# EAGLE design video_xchng_v4 (EAGLE 9.6.2)
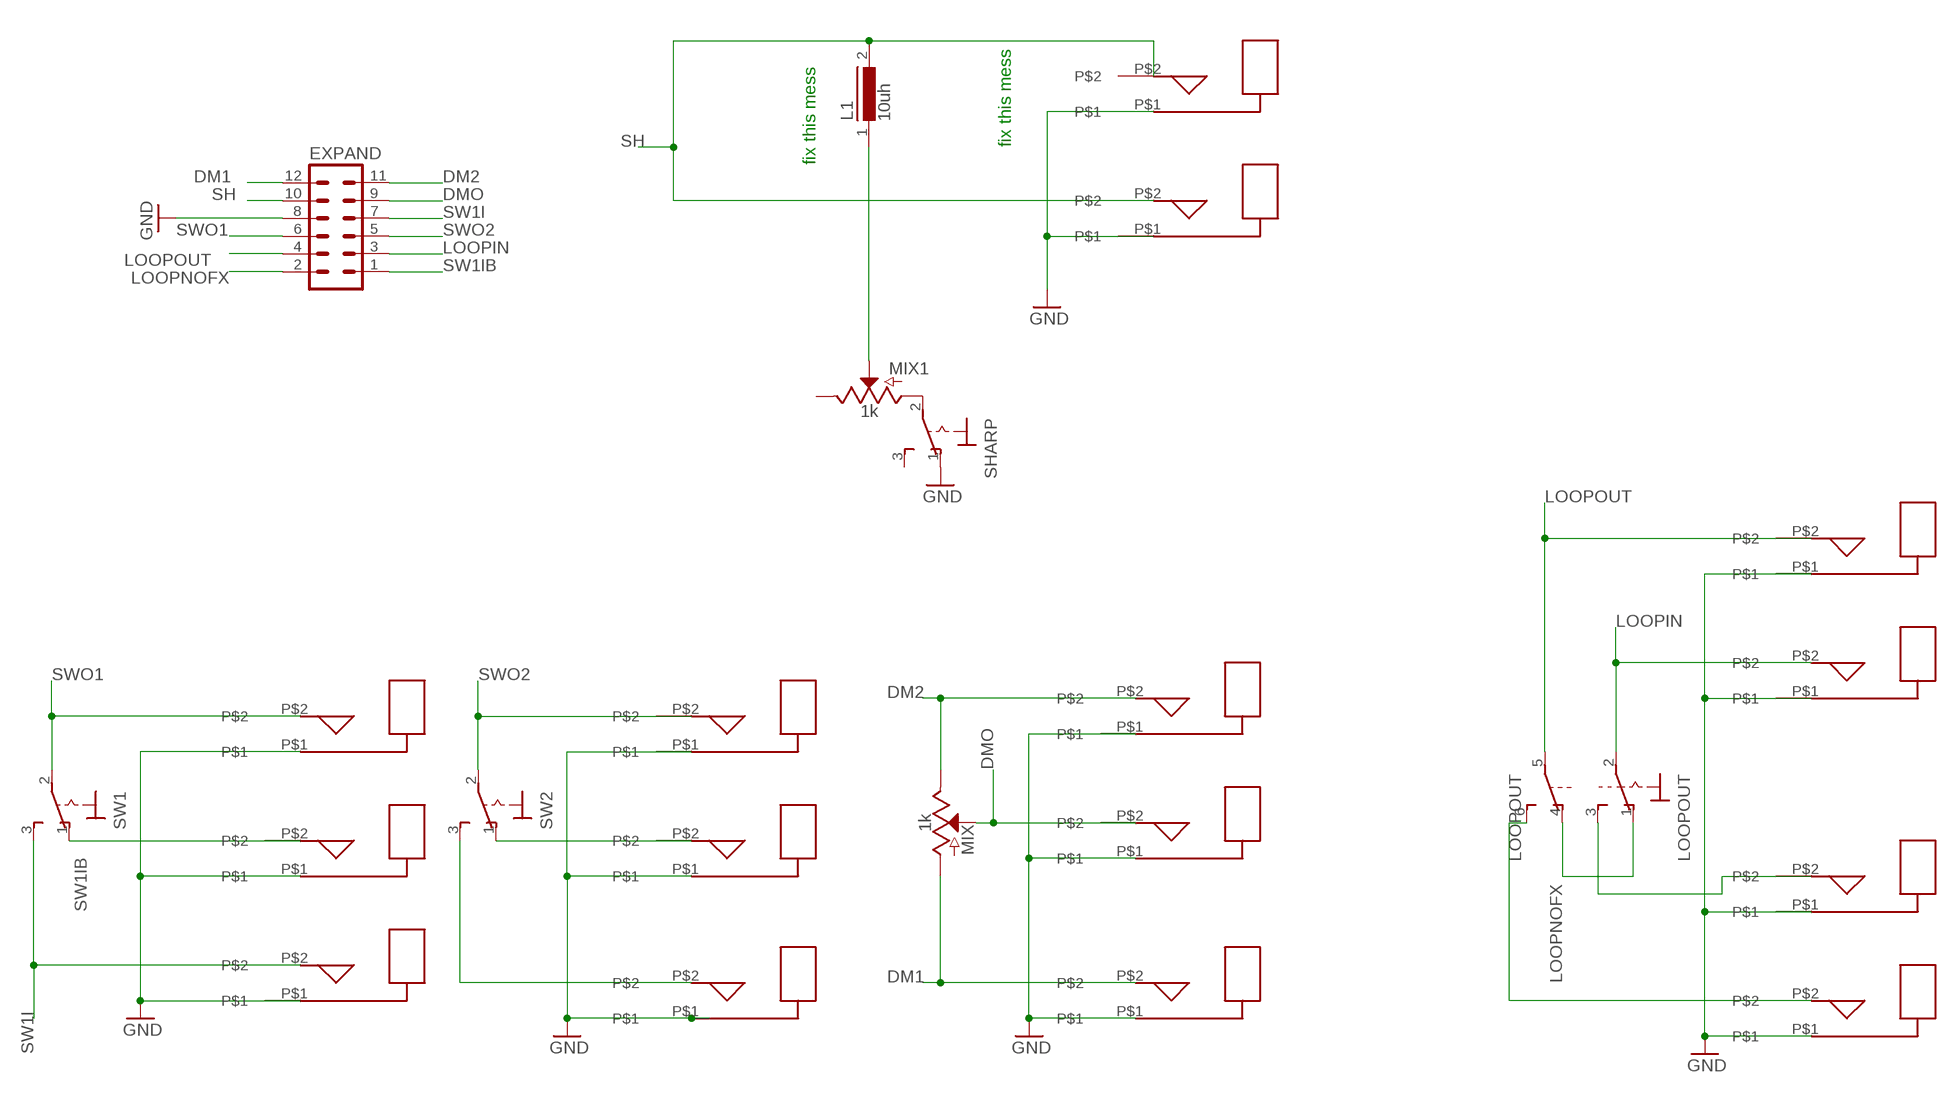
[diagram p0: schematic, sheet 1]

## Parts
EXPAND  MA06-2  [MA06-2]
L1  10uh  LBC15  [LBC15]
LOOPOUT  M9040P2  [M9040P2]
MIX  1k  POTENTIOMETER-PTH-9MM-1/20W-20%  [POT-PTH-ALPS]
MIX1  1k  POTENTIOMETER-PTH-9MM-1/20W-20%  [POT-PTH-ALPS]
SHARP  M9040P  [M9040P]
SHARPIN  RCJJACK,VERTICAL,PCBMOUNT  [RCJJACK,VERTICAL,PCBMOUNT]
SW1  M9040P  [M9040P]
SW2  M9040P  [M9040P]
U$1  RCJJACK,VERTICAL,PCBMOUNT  [RCJJACK,VERTICAL,PCBMOUNT]
U$2  RCJJACK,VERTICAL,PCBMOUNT  [RCJJACK,VERTICAL,PCBMOUNT]
U$3  RCJJACK,VERTICAL,PCBMOUNT  [RCJJACK,VERTICAL,PCBMOUNT]
U$4  RCJJACK,VERTICAL,PCBMOUNT  [RCJJACK,VERTICAL,PCBMOUNT]
U$5  RCJJACK,VERTICAL,PCBMOUNT  [RCJJACK,VERTICAL,PCBMOUNT]
U$6  RCJJACK,VERTICAL,PCBMOUNT  [RCJJACK,VERTICAL,PCBMOUNT]
U$7  RCJJACK,VERTICAL,PCBMOUNT  [RCJJACK,VERTICAL,PCBMOUNT]
U$8  RCJJACK,VERTICAL,PCBMOUNT  [RCJJACK,VERTICAL,PCBMOUNT]
U$9  RCJJACK,VERTICAL,PCBMOUNT  [RCJJACK,VERTICAL,PCBMOUNT]
U$10  RCJJACK,VERTICAL,PCBMOUNT  [RCJJACK,VERTICAL,PCBMOUNT]
U$11  RCJJACK,VERTICAL,PCBMOUNT  [RCJJACK,VERTICAL,PCBMOUNT]
U$12  RCJJACK,VERTICAL,PCBMOUNT  [RCJJACK,VERTICAL,PCBMOUNT]
U$13  RCJJACK,VERTICAL,PCBMOUNT  [RCJJACK,VERTICAL,PCBMOUNT]
U$15  RCJJACK,VERTICAL,PCBMOUNT  [RCJJACK,VERTICAL,PCBMOUNT]

## Nets
DM1: EXPAND.12 MIX.P$3(A) U$9.P$2
DM2: EXPAND.11 MIX.P$1(E) U$7.P$2
DMO: EXPAND.9 MIX.P$2(S) U$8.P$2
GND: EXPAND.8 SHARP.1(O) SHARPIN.P$1 U$1.P$1 U$2.P$1 U$3.P$1 U$4.P$1 U$5.P$1 U$6.P$1 U$7.P$1 U$8.P$1 U$9.P$1 U$10.P$1 U$11.P$1 U$12.P$1 U$13.P$1 U$15.P$1
LOOPIN: EXPAND.3 LOOPOUT.2(1:P) U$11.P$2
LOOPNOFX: EXPAND.2 LOOPOUT.1(1:O) LOOPOUT.4(2:O)
LOOPOUT: EXPAND.4 LOOPOUT.5(2:P) U$10.P$2
N$1: MIX1.P$3(A) SHARP.2(P)
N$6: SW2.1(O) U$5.P$2
N$8: SW2.3(S) U$6.P$2
N$16: LOOPOUT.3(1:S) U$12.P$2
N$17: LOOPOUT.6(2:S) U$13.P$2
N$19: L1.1 MIX1.P$2(S)
SH: EXPAND.10 L1.2 SHARPIN.P$2 U$15.P$2
SW1I: EXPAND.7 SW1.3(S) U$3.P$2
SW1IB: EXPAND.1 SW1.1(O) U$2.P$2
SWO1: EXPAND.6 SW1.2(P) U$1.P$2
SWO2: EXPAND.5 SW2.2(P) U$4.P$2
Unconnected: MIX1.P$1(E) SHARP.3(S)

## Notes on the sheet
- fix this mess
- fix this mess

## Library data of the parts
EXPAND = con-lstb:MA06-2: PIN HEADER; OC_FARNELL: unknown; OC_NEWARK: unknown
L1 = inductors:LBC15: INDUCTOR; SPICEPREFIX: L
LOOPOUT = switch:M9040P2: TOGGLE SWITCH Marquardt
MIX MIX1 = SparkFun-Resistors:POTENTIOMETER: Potentiometer (Pot) Three-terminal potentiometers, with an adjustable wiper and two adjustable resistors. A pot can be used to create a configurable voltage divider, or as a variable resistor. Variants ALPS_POT and ALPS_POT_KIT - PTH, breadboard compatible, 9mm square pots Rotary Potentiometer - Linear (10k ohm) <https://www.sparkfun.com/products/9288> (COM-09288) The KIT variant exposes copper on only one side of the PTH pad, so the part can only be assembled on one side of the PCB. Useful for beginner soldering kits.; PROD_ID: RES-09177; SF_SKU: COM-09288; VALUE: 10k
SHARP SW1 SW2 = switch:M9040P: TOGGLE SWITCH Marquardt
SHARPIN U$1-U$13 U$15 = CFOG_LIB1:RCJJACK,VERTICAL,PCBMOUNT

## Board
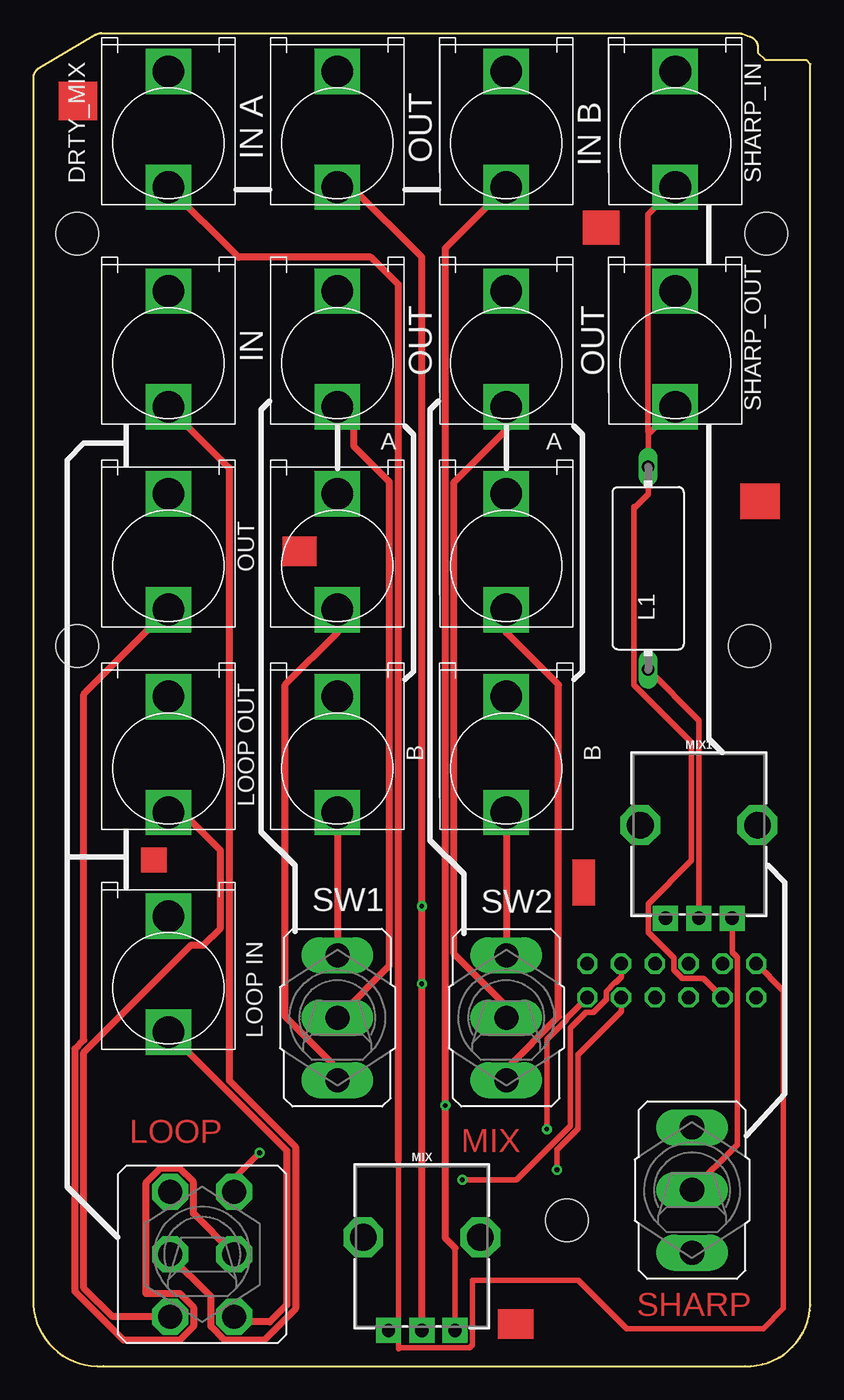
[diagram p1: board, top side]
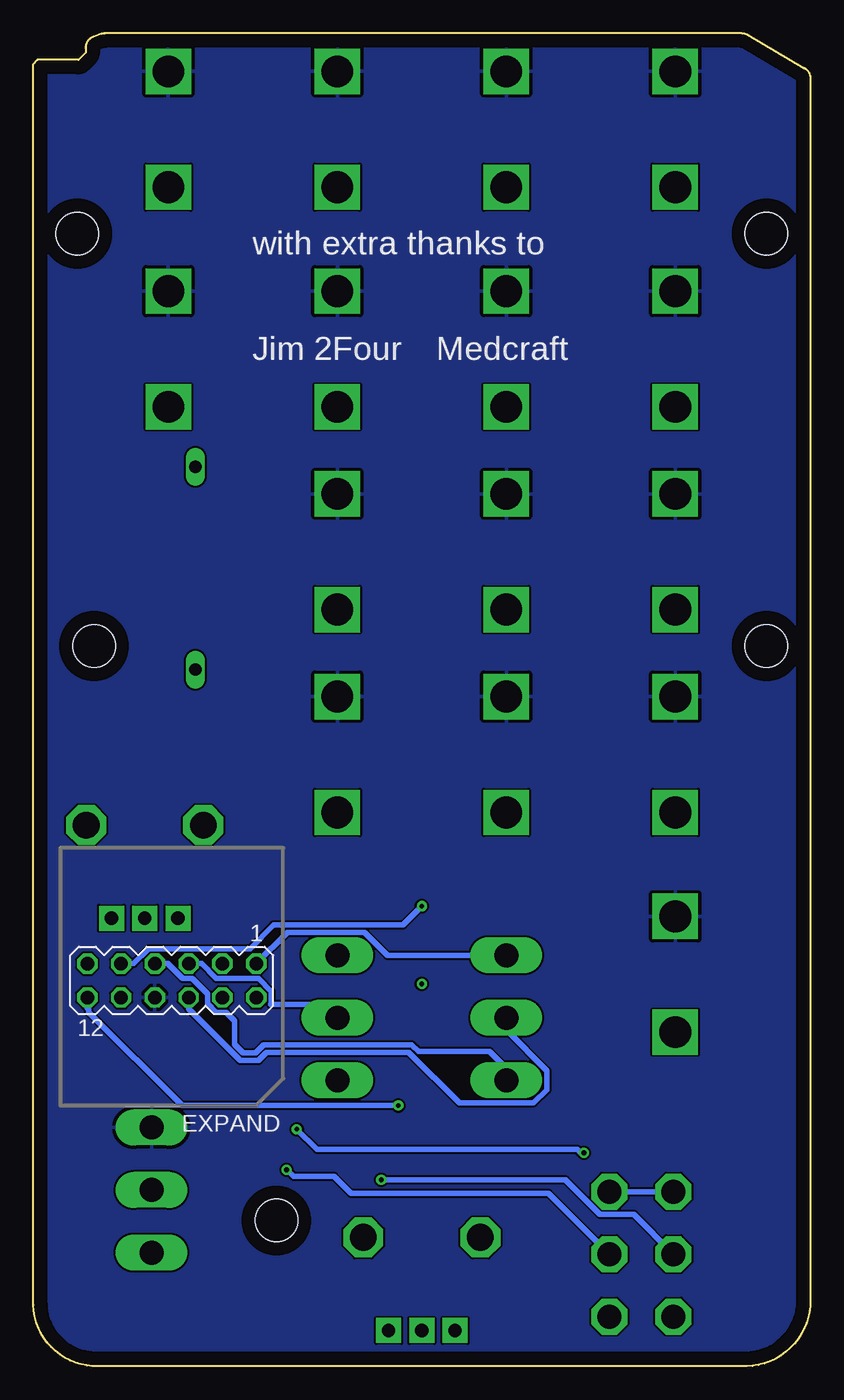
[diagram p2: board, bottom side, seen from below]

Size 58.42 x 100.19 mm. Coordinates in mm from the lower left corner, seen from the top.
Outline: 5.26,0.01 53.52,0.01 arc90 58.42,4.61 58.42,97.88 58.12,98.18 55.02,98.18 54.48,98.71 54.48,99.1 arc71 53.88,99.94 53.3,100.14 arc19 53.01,100.19 5.14,100.19 arc30 4.69,100.06 0.44,97.57 arc60 0,96.81 0,4.61 arc90 5.26,0.01
Copper layers (1*16): Top 0.035mm / dielectric 1.5mm / Bottom 0.035mm
Design rules "default": minimum track width 6mil, minimum drill 0.35mm, track to track 6mil, track to pad 6mil, pad to pad 6mil, via to via 6mil, smd to smd 6mil, copper to edge 40mil, drill to drill 6mil, minimum pad ring 10mil, minimum via ring 8mil, stop-mask expansion 4mil, vias tented up to drill 0mil, thermal gap 10mil
Holes 3.2 mm at 3.3,85.12 55.12,85.12 53.85,54.14 3.3,54.14 40.13,10.96

### Footprints (pad centres in the part's own frame; a part is rotated, then mirrored left to right if it is on the bottom)
MA06-2 = drill 1.016 octagon: 1 -6.35,-1.27; 2 -6.35,1.27; 3 -3.81,-1.27; 4 -3.81,1.27; 5 -1.27,-1.27; 6 -1.27,1.27; 7 1.27,-1.27; 8 1.27,1.27; 9 3.81,-1.27; 10 3.81,1.27; 11 6.35,-1.27; 12 6.35,1.27
LBC15 = drill 0.914 long: 1 -7.62,0; 2 7.62,0
M9040P2 = drill 1.803 octagon: 1 -2.413,4.699; 2 -2.413,0; 3 -2.413,-4.699; 4 2.413,4.699; 5 2.413,0; 6 2.413,-4.699
POT-PTH-ALPS = drill 1 pad 1.88 square: P$1 7,-2.5; P$2 7,0; P$3 7,2.5 | drill 2 octagon: P$4 0,-4.4; P$5 0,4.4
M9040P = drill 1.803 long: 1 0,4.699; 2 0,0; 3 0,-4.699
RCJJACK,VERTICAL,PCBMOUNT = drill 2.39 pad 2.8 square: P$1 0,0; P$2 0,8.7

### Placement (x,y rotation side)
EXPAND  48.01,28.99 180 bottom
L1  46.23,59.98 90 top
LOOPOUT  12.7,8.42 0 top
MIX  29.21,9.69 270 top
MIX1  50.04,40.67 270 top
SHARP  49.53,13.24 0 top
SHARPIN  48.26,97.32 180 top
SW1  22.86,26.2 0 top
SW2  35.56,26.2 0 top
U$1  22.86,80.81 180 top
U$2  22.86,50.33 180 top
U$3  22.86,65.57 180 top
U$4  35.56,80.81 180 top
U$5  35.56,50.33 180 top
U$6  35.56,65.57 180 top
U$7  10.16,97.32 180 top
U$8  22.86,97.32 180 top
U$9  35.56,97.32 180 top
U$10  10.16,65.57 180 top
U$11  10.16,80.81 180 top
U$12  10.16,50.33 180 top
U$13  10.16,33.82 180 top
U$15  48.26,80.81 180 top

### Tracks (layer width: path | path; a pad name or v marks a point on that pad's centre or on a via)
DM1  (via drill 0.35)
  Top 0.406: 31.71,8.89 MIX.P$3
  Top 0.508: 31.71,8.89 30.98,9.62 v30.98,19.59 30.98,84.03 U$9.P$2
  Bottom 0.406: v30.98,19.59 47.24,19.59 54.26,26.61 54.26,26.84 54.36,26.93 EXPAND.12
DM2
  Top 0.406: 27.44,15.53 27.44,3.56 | 27.44,3.56 26.71,2.83 | 27.44,3.56 27.44,1.32 27.52,1.39 32.8,1.39 33.01,1.6 33.01,6.46 40.99,6.46 44.62,2.82 54.87,2.82 56.39,4.34 56.39,28.23 EXPAND.11
  Top 0.508: 26.71,2.83 MIX.P$1 | 27.44,15.53 27.44,81.3 25.4,83.35 15.43,83.35 U$7.P$2
DMO  (via drill 0.35)
  Top 0.508: MIX.P$2 v29.21,28.74 v29.21,34.58 29.21,83.35 23.94,88.62 U$8.P$2
  Bottom 0.406: EXPAND.9 50.86,30.26 49.74,31.38 42.12,31.38 40.34,33.16 30.63,33.16 v29.21,34.58
GND
  pour Bottom: -5.08,122.72 52.07,122.72 60.96,113.83 60.96,-22.06 -8.89,-22.06 -8.89,112.56 -13.97,117.64
LOOPIN  (via drill 0.35)
  Top 0.406: v32.26,14 36.32,14 40.39,18.07 40.39,25.43 41.55,26.6 42.12,26.6 43.08,27.56 43.08,28.18 43.73,28.84 43.79,28.84 44.2,29.24 EXPAND.3
  Top 0.508: U$11.P$2 14.74,67.52 14.74,21.47 19.71,16.5 19.71,4.33 17.34,1.96 14.38,1.96 13.35,2.99 13.35,5.22 10.16,8.42 LOOPOUT.2
  Bottom 0.406: v32.26,14 18.42,14 15.82,11.41 13.28,11.41 LOOPOUT.2
LOOPNOFX  (via drill 0.35)
  Top 0.406: EXPAND.2 40.09,26.16 40.09,26.03 38.62,24.56 38.62,20.79 38.61,20.78 v38.61,17.81 | v17.02,16.04 15.11,14.13 LOOPOUT.4
  Bottom 0.406: LOOPOUT.1 LOOPOUT.4 | v38.61,17.81 37.08,16.29 17.53,16.29 17.27,16.04 v17.02,16.04
LOOPOUT  (via drill 0.35)
  Top 0.406: v39.37,14.77 39.37,16.26 40.95,17.84 40.95,23.4 | 40.95,23.4 40.95,23.45 | 40.95,23.4 44.2,26.65 EXPAND.4
  Top 0.508: LOOPOUT.5 12.05,11.48 12.05,13.84 11.02,14.87 9.56,14.87 8.46,13.78 8.46,5.48 11.02,5.48 12.05,4.45 12.05,2.99 11.02,1.96 6.79,1.96 3.15,5.6 3.15,23.86 3.81,24.52 3.81,50.52 U$10.P$2
  Bottom 0.406: LOOPOUT.5 19.69,12.99 34.54,12.99 35.81,14.26 38.86,14.26 v39.37,14.77
N$1
  Top 0.406: MIX1.P$3 52.54,31.12 52.93,30.72 52.93,16.65 SHARP.2
N$6
  Top 0.508: U$5.P$2 SW2.1
N$8
  Top 0.508: SW2.3 35.56,22.36 39.48,26.28 39.48,51.22 35.56,55.15 U$6.P$2
N$16
  Top 0.508: U$12.P$2 10.16,42.71 14.08,38.78 14.08,32.92 12.81,31.65 11.88,31.65 3.81,23.59 3.81,5.88 5.97,3.72 LOOPOUT.3
N$17
  Top 0.508: U$13.P$2 19.05,16.23 19.05,4.61 17.78,3.34 15.24,3.34 15.11,3.46 LOOPOUT.6
N$19
  Top 0.406: L1.1 50.04,48.55 MIX1.P$2
SH
  Top 0.406: L1.2 46.23,70.23 46.2,70.26 46.2,86.56 SHARPIN.P$2 | L1.2 46.23,67.32 46.23,65.57 45.21,64.55 45.16,64.6 45.16,51.21 49.48,46.89 49.48,38 46.24,34.76 46.24,32.59 48.16,30.67 48.16,29.8 48.81,29.14 50.39,29.14 EXPAND.10 | U$15.P$2 46.23,70.07 L1.2
SW1I
  Top 0.508: SW1.3 22.86,22.36 18.94,26.28 18.94,51.22 22.86,55.15 U$3.P$2
  Bottom 0.406: SW1.3 22.86,22.39 24.13,23.66 29.46,23.66 29.97,24.16 41.09,24.16 41.7,23.55 42.63,23.55 43.28,24.21 43.28,25.96 43.42,26.09 43.93,26.6 44.66,26.6 45.31,27.26 45.31,27.99 46.47,29.14 47.2,29.14 48.32,30.26 EXPAND.7
SW1IB
  Top 0.508: U$2.P$2 SW1.1
  Bottom 0.406: SW1.1 31.79,30.9 33.5,32.6 39.31,32.6 EXPAND.1
SWO1
  Top 0.508: SW1.2 26.78,30.12 26.78,66.46 24.13,69.12 24.13,71.92 22.86,71.92 U$1.P$2
  Bottom 0.406: SW1.2 22.86,25.27 19.8,22.21 19.8,20.79 20.8,19.79 26.39,19.79 30.2,23.61 40.86,23.61 41.47,23 42.86,23 46.74,26.87 EXPAND.6
SWO2
  Top 0.508: SW2.2 35.56,27.06 31.64,30.98 31.64,66.46 35.56,70.39 35.56,70.65 34.29,71.92 34.48,72.11 U$4.P$2
  Bottom 0.406: SW2.2 36.58,27.21 40.58,27.21 40.54,27.26 40.54,28.18 41.5,29.14 44.66,29.14 45.78,30.26 EXPAND.5
(copper drawn outside any net)
  shapes: Top area x7

### Text on the board
Top: LOOP | MIX | SHARP
tPlace: IN A | OUT | IN B | DRTY_MIX | SHARP_IN | IN | OUT | OUT | SHARP_OUT | A | A | OUT | B | B | LOOP OUT | LOOP IN
bNames: with extra thanks to | Jim 2FourҜ Medcraft
tStop: LOOP | MIX | SHARP
bDocu: Made with the help of over 165 backers! | CFOGE | VIDEO_XCHNG_V1.3 2021 | not power! for real! | SWO2 | SW1I | DMO | SW1IB | LOOPIN | DM2 | NOFX_I | NOFX_O | SWO1 | GND | SH | DM1